# EasyEDA Pro project v8_fBACKUP as orderered.eprj

# Schematic Schematic1
Board Name: Board1; Create Date: 2025-07-11; Page Name: P1; Project Name: v8_f; Schematic Name: Schematic1; Update Date: 2025-08-22; Company: KC3LBR; Drawed: EasyEDA Pro; Page Size: A3; Part Number: JLCPCB-001; Reviewed: EasyEDA Pro; Version: 2023.09.11
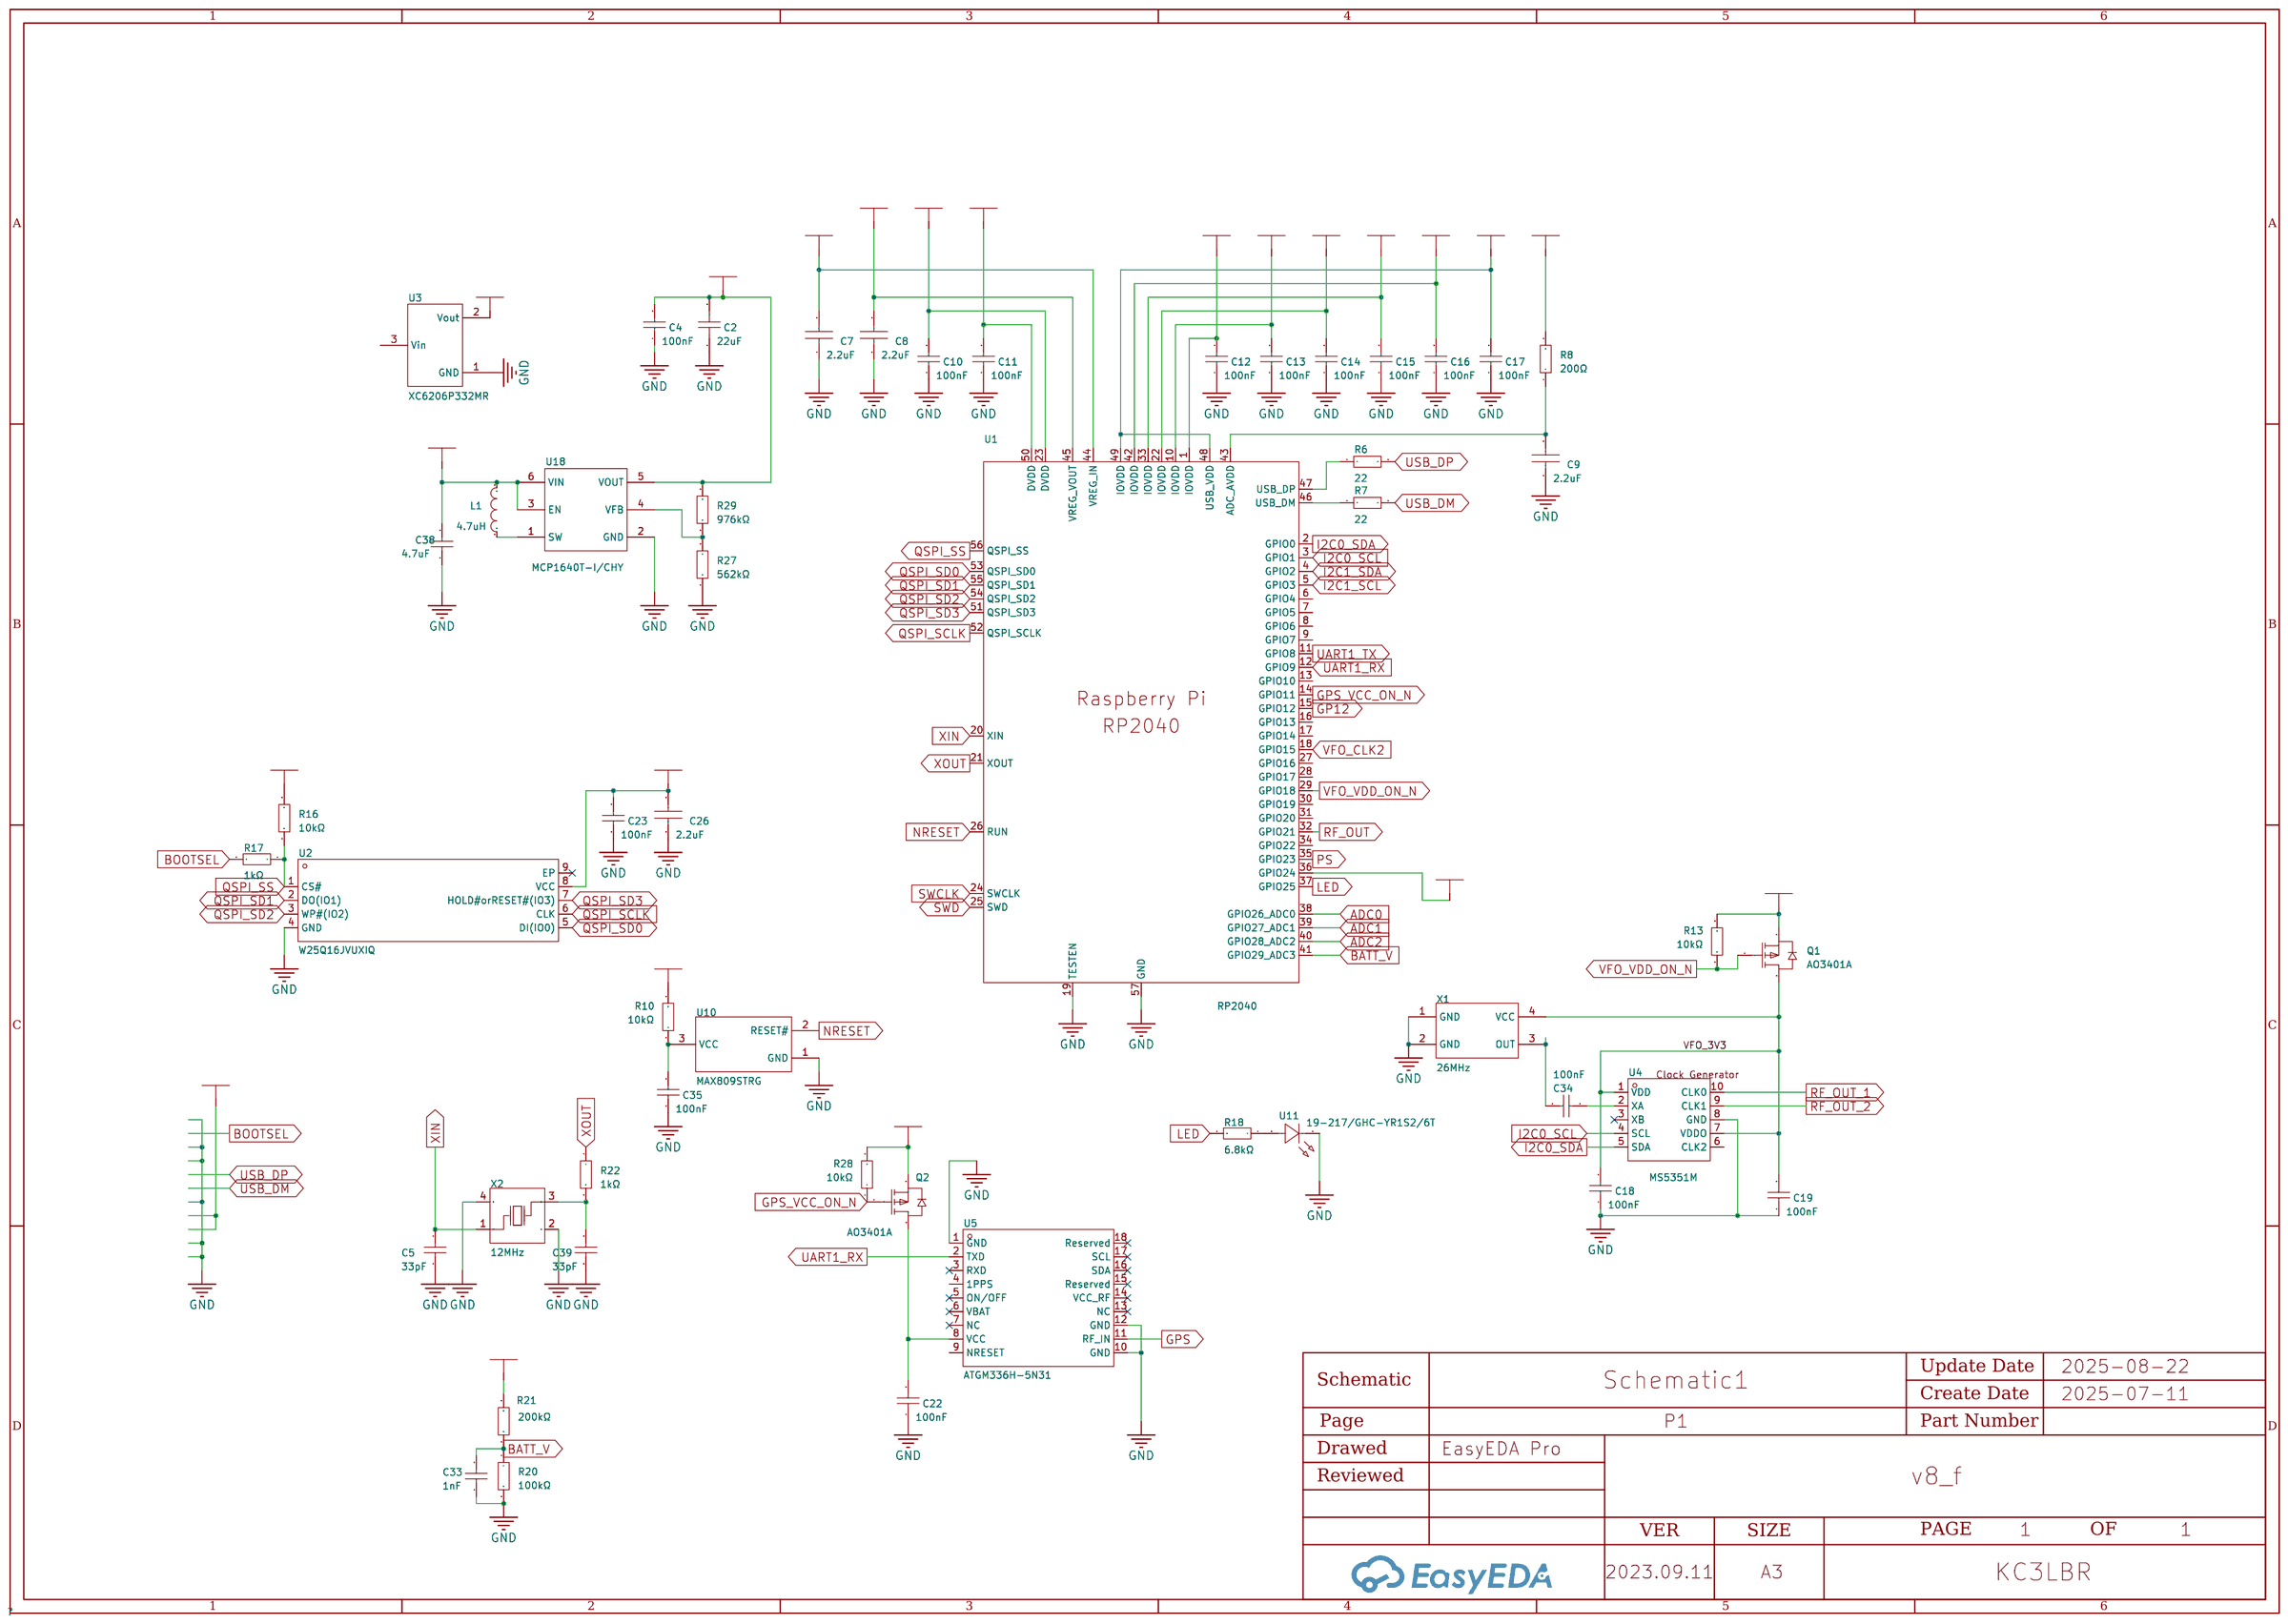
[diagram p0: schematic sheet]

## Parts
C2  22uF  [C0603]
C4  100nF  [C0402]
C5  33pF  [C0402]
C7  2.2uF  [C0402]
C8  2.2uF  [C0402]
C9  2.2uF  [C0402]
C10  100nF  [C0402]
C11  100nF  [C0402]
C12  100nF  [C0402]
C13  100nF  [C0402]
C14  100nF  [C0402]
C15  100nF  [C0402]
C16  100nF  [C0402]
C17  100nF  [C0402]
C18  100nF  [C0402_NEW]
C19  100nF  [C0402_NEW]
C22  100nF  [C0402]
C23  100nF  [C0402]
C26  2.2uF  [C0402]
C33  1nF  [C0402]
C34  100nF  [C0402_NEW]
C35  100nF  [C0402_NEW]
C38  4.7uF  [C0603]
C39  33pF  [C0402]
L1  4.7uH  [IND-SMD_L2.5-W1.8]
Q1  AO3401A  [SOT-23_L2.9-W1.3-P1.90-LS2.4-BR]
Q2  AO3401A  [SOT-23_L2.9-W1.3-P1.90-LS2.4-BR]
R6  22  [R0402]
R7  22  [R0402]
R8  200Ω  [R0402]
R10  10kΩ  [R0402]
R13  10kΩ  [R0402]
R16  10kΩ  [R0402]
R17  1kΩ  [R0402]
R18  6.8kΩ  [R0402]
R20  100kΩ  [R0402]
R21  200kΩ  [R0402]
R22  1kΩ  [R0402]
R27  562kΩ  [R0402]
R28  10kΩ  [R0402]
R29  976kΩ  [R0402]
U1  RP2040  [LQFN-56_L7.0-W7.0-P0.4-EP]
U2  W25Q16JVUXIQ  [USON-8_L3.0-W2.0-P0.50-BL-EP]
U3  XC6206P332MR  [SOT-23-3_L2.9-W1.3-P1.90-LS2.4-BR]
U4  MS5351M  [MSOP-10_L3.0-W3.0-P0.50-LS5.0-BL]
U5  ATGM336H-5N31  [GPSM-SMD_ATGM336H-TR]
U10  MAX809STRG  [SOT-23-3_L2.9-W1.6-P1.90-LS2.8-BR]
U11  19-217/GHC-YR1S2/6T  [LED0603-RD_GREEN]
U18  MCP1640T-I/CHY  [SOT-23-6_L2.9-W1.6-P0.95-LS2.8-BR]
X1  26MHz  [OSC-SMD_4P-L2.5-W2.0-BL]
X2  12MHz  [CRYSTAL-SMD_4P-L3.2-W2.5-BL]

## Library data of the parts
C2 = CL10A226MQ8NRNC: Capacitance: Tolerance:±20% Tolerance:±20% Voltage Rated: Temperature Coefficient:; LCSC Part Name: 22uF ±20% 6.3V; Supplier Part: C59461; Manufacturer: SAMSUNG(三星); Supplier Footprint: 0603; JLCPCB Part Class: Basic Part; Datasheet: https://atta.szlcsc.com/upload/public/pdf/source/20160218/1457707763339.pdf; Supplier: LCSC; Tolerance: ±20%
C4 C10-C17 C22 C23 = CL05B104KO5NNNC: Capacitance: Tolerance:±10% Tolerance:±10% Voltage Rated: Temperature Coefficient:; LCSC Part Name: 100nF ±10% 16V; Supplier Part: C1525; Manufacturer: SAMSUNG(三星); Supplier Footprint: 0402; JLCPCB Part Class: Basic Part; Datasheet: https://atta.szlcsc.com/upload/public/pdf/source/20160218/1457707763339.pdf; Supplier: LCSC; Tolerance: ±10%
C5 C39 = 0402CG330J500NT: Capacitance: Tolerance:±5% Tolerance:±5% Voltage Rated: Temperature Coefficient:; LCSC Part Name: 33pF ±5% 50V; Supplier Part: C1562; Manufacturer: FH(风华); Supplier Footprint: 0402; JLCPCB Part Class: Basic Part; Datasheet: https://atta.szlcsc.com/upload/public/pdf/source/20200305/C486355_26A10D38EF8C2A5C37091D0039909270.pdf; Supplier: LCSC; Tolerance: ±5%
C7-C9 C26 = CL05A225MQ5NSNC: Capacitance: Tolerance:±20% Tolerance:±20% Voltage Rated: Temperature Coefficient:; LCSC Part Name: 2.2uF ±20% 6.3V; Supplier Part: C12530; Manufacturer: SAMSUNG(三星); Supplier Footprint: 0402; JLCPCB Part Class: Basic Part; Datasheet: https://atta.szlcsc.com/upload/public/pdf/source/20160218/1457707763339.pdf; Supplier: LCSC; Tolerance: ±20%
C18 C19 C34 C35 = CL05B104KO5NNNC: Capacitance: Tolerance:±10% Tolerance:±10% Voltage Rated: Temperature Coefficient:; LCSC Part Name: 100nF ±10% 16V; Supplier Part: C1525; Manufacturer: SAMSUNG(三星); Supplier Footprint: 0402; JLCPCB Part Class: Basic Part; Datasheet: https://atta.szlcsc.com/upload/public/pdf/source/20160103/1457707674891.pdf; Supplier: LCSC; Tolerance: ±10%
C33 = 0402B102K500NT: Capacitance: Tolerance:±10% Tolerance:±10% Voltage Rated: Temperature Coefficient:; LCSC Part Name: 1nF ±10% 50V; Supplier Part: C1523; Manufacturer: FH(风华); Supplier Footprint: 0402; JLCPCB Part Class: Basic Part; Datasheet: https://atta.szlcsc.com/upload/public/pdf/source/20170923/C1523_1506149254821988331.pdf; Supplier: LCSC; Tolerance: ±10%
C38 = CL10A475KO8NNNC: Capacitance: Tolerance:±10% Tolerance:±10% Voltage Rated: Temperature Coefficient:; LCSC Part Name: 4.7uF ±10% 16V; Supplier Part: C19666; Manufacturer: SAMSUNG(三星); Supplier Footprint: 0603; JLCPCB Part Class: Basic Part; Datasheet: https://atta.szlcsc.com/upload/public/pdf/source/20160103/1457707703134.pdf; Supplier: LCSC; Tolerance: ±10%
L1 = CBC2518T4R7M: Type:- Inductance: Tolerance:±20% Tolerance:±20% Rated Current: Saturation Current (Isat):680mA DC Resistance (DCR): Ratings:-; LCSC Part Name: 4.7uH ±20% 680mA; Supplier Part: C268002; Manufacturer: TAIYO YUDEN(太诱); Supplier Footprint: SMD; JLCPCB Part Class: Extended Part; Datasheet: https://atta.szlcsc.com/upload/public/pdf/source/20180820/C268002_0E22732304EF0852B3951C6629BBBAB5.pdf; Supplier: LCSC; Tolerance: ±20%; Saturation Current (Isat): 680mA
Q1 Q2 = AO3401A_C15127: Type: Drain Source Voltage (Vdss): Continuous Drain Current (Id): Power Dissipation (Pd): Drain Source On Resistance (RDS(on)@Vgs,Id):44mΩ@10V,4.3A Gate Threshold Voltage (Vgs(th)@Id):1.3V@250uA; LCSC Part Name: P沟道 30V 4A; Supplier Part: C15127; Manufacturer: AOS; Supplier Footprint: SOT-23; JLCPCB Part Class: Basic Part; Datasheet: https://atta.szlcsc.com/upload/public/pdf/source/20160507/1462613609053.pdf; Supplier: LCSC; Drain Source On Resistance (RDS(on)@Vgs,Id): 44mΩ@10V,4.3A; Gate Threshold Voltage (Vgs(th)@Id): 1.3V@250uA
R6 R7 = 0402WGF220JTCE: LCSC Part Name: 22Ω(22R0) ±1% 编带; Supplier Part: C25092; Manufacturer: UNI-ROYAL(厚声); Supplier Footprint: 0402; JLCPCB Part Class: Basic Part; Datasheet: https://atta.szlcsc.com/upload/public/pdf/source/20170920/C25092_1505901206069982723.pdf; Supplier: LCSC
R8 = 0402WGF2000TCE: Type:Thick Film Resistors Resistance: Tolerance:±1% Tolerance:±1% Power(Watts): Temperature Coefficient:±100ppm/ Temperature Coefficient:±100ppm/ Overload Voltage (Max): Operating Temperature Range:-55~+155 Operating Temperature Range:-55~+155; LCSC Part Name: 200Ω ±1% 62.5mW; Supplier Part: C25087; Manufacturer: UNI-ROYAL(厚声); Supplier Footprint: 0402; JLCPCB Part Class: Basic Part; Datasheet: https://atta.szlcsc.com/upload/public/pdf/source/20200306/C422600_1E6D84923E4A46A82E41ADD87F860B5C.pdf; Supplier: LCSC; Type: Thick Film Resistors; Tolerance: ±1%; Temperature Coefficient: ±100ppm/; Operating Temperature Range: -55~+155
R10 R13 R16 R28 = 0402WGF1002TCE: Type:Thick Film Resistors Resistance: Tolerance:±1% Tolerance:±1% Power(Watts): Temperature Coefficient:±100ppm/ Temperature Coefficient:±100ppm/ Overload Voltage (Max): Operating Temperature Range:-55~+155 Operating Temperature Range:-55~+155; LCSC Part Name: 10kΩ ±1% 62.5mW; Supplier Part: C25744; Manufacturer: UNI-ROYAL(厚声); Supplier Footprint: 0402; JLCPCB Part Class: Basic Part; Datasheet: https://atta.szlcsc.com/upload/public/pdf/source/20200306/C422600_1E6D84923E4A46A82E41ADD87F860B5C.pdf; Supplier: LCSC; Type: Thick Film Resistors; Tolerance: ±1%; Temperature Coefficient: ±100ppm/; Operating Temperature Range: -55~+155
R17 R22 = 0402WGF1001TCE: Type:Thick Film Resistors Resistance: Tolerance:±1% Tolerance:±1% Power(Watts): Temperature Coefficient:±100ppm/ Temperature Coefficient:±100ppm/ Overload Voltage (Max): Operating Temperature Range:-55~+155 Operating Temperature Range:-55~+155; LCSC Part Name: 1kΩ ±1% 62.5mW; Supplier Part: C11702; Manufacturer: UNI-ROYAL(厚声); Supplier Footprint: 0402; JLCPCB Part Class: Basic Part; Datasheet: https://atta.szlcsc.com/upload/public/pdf/source/20200306/C422600_1E6D84923E4A46A82E41ADD87F860B5C.pdf; Supplier: LCSC; Type: Thick Film Resistors; Tolerance: ±1%; Temperature Coefficient: ±100ppm/; Operating Temperature Range: -55~+155
R18 = 0402WGF6801TCE: Type:Thick Film Resistors Resistance: Tolerance:±1% Tolerance:±1% Power(Watts): Temperature Coefficient:±100ppm/ Temperature Coefficient:±100ppm/ Overload Voltage (Max): Operating Temperature Range:-55~+155 Operating Temperature Range:-55~+155; LCSC Part Name: 6.8kΩ ±1% 62.5mW; Supplier Part: C25917; Manufacturer: UNI-ROYAL(厚声); Supplier Footprint: 0402; JLCPCB Part Class: Basic Part; Datasheet: https://atta.szlcsc.com/upload/public/pdf/source/20200306/C422600_1E6D84923E4A46A82E41ADD87F860B5C.pdf; Supplier: LCSC; Type: Thick Film Resistors; Tolerance: ±1%; Temperature Coefficient: ±100ppm/; Operating Temperature Range: -55~+155
R20 = 0402WGF1003TCE: Type:Thick Film Resistors Resistance: Tolerance:±1% Tolerance:±1% Power(Watts): Temperature Coefficient:±100ppm/ Temperature Coefficient:±100ppm/ Overload Voltage (Max): Operating Temperature Range:-55~+155 Operating Temperature Range:-55~+155; LCSC Part Name: 100kΩ ±1% 62.5mW; Supplier Part: C25741; Manufacturer: UNI-ROYAL(厚声); Supplier Footprint: 0402; JLCPCB Part Class: Basic Part; Datasheet: https://atta.szlcsc.com/upload/public/pdf/source/20200306/C422600_1E6D84923E4A46A82E41ADD87F860B5C.pdf; Supplier: LCSC; Type: Thick Film Resistors; Tolerance: ±1%; Temperature Coefficient: ±100ppm/; Operating Temperature Range: -55~+155
R21 = 0402WGF2003TCE: Resistance: Tolerance: Power(Watts): Temperature Coefficient: Temperature Coefficient: Overload Voltage (Max): Operating Temperature Range: Operating Temperature Range:; LCSC Part Name: 200KΩ ±1%; Supplier Part: C25764; Manufacturer: UNI-ROYAL(厚声); Supplier Footprint: 0402; JLCPCB Part Class: Basic Part; Datasheet: https://atta.szlcsc.com/upload/public/pdf/source/20170920/C25764_1505901532268983339.pdf; Supplier: LCSC
R27 = RC0402FR-07562KL: Type:Thick Film Resistors Resistance: Tolerance:±1% Tolerance:±1% Power(Watts): Overload Voltage (Max): Temperature Coefficient:±100ppm/℃ Temperature Coefficient:±100ppm/℃ Operating Temperature Range:-55℃~+155℃ Operating Temperature Range:-55℃~+155℃; LCSC Part Name: 厚膜电阻 562kΩ ±1% 62.5mW; Supplier Part: C273337; Manufacturer: YAGEO(国巨); Supplier Footprint: 0402; JLCPCB Part Class: Extended Part; Datasheet: https://atta.szlcsc.com/upload/public/pdf/source/20180821/C275644_0D56F95EFF785E7D9A1FEF436B37DA78.pdf; Supplier: LCSC; Type: Thick Film Resistors; Tolerance: ±1%; Temperature Coefficient: ±100ppm/℃; Operating Temperature Range: -55℃~+155℃
R29 = 0402WGF9763TCE: Type:Thick Film Resistor Resistance:976kΩ Tolerance:±1% Tolerance:±1% Power(Watts):62.5mW Voltage-Supply(Max):50V Temperature Coefficient:±100ppm/℃ Temperature Coefficient:±100ppm/℃ Operating Temperature:-55℃~+155℃ Operating Temperature:-55℃~+155℃; LCSC Part Name: 976kΩ ±1% 62.5mW 厚膜电阻; Supplier Part: C25802; Manufacturer: UNI-ROYAL(厚声); Supplier Footprint: 0402; JLCPCB Part Class: Extended Part; Datasheet: https://item.szlcsc.com/datasheet/0402WGF9763TCE/26545.html; Supplier: LCSC; Type: Thick Film Resistor; Tolerance: ±1%; Power(Watts): 62.5mW; Voltage-Supply(Max): 50V; Temperature Coefficient: ±100ppm/℃; Operating Temperature: -55℃~+155℃
U1 = RP2040_C2040: CPU Core:- RAM Size:264KB GPIO Ports Number:30 Operating Voltage Range:- Operating Voltage Range:- CPU Maximum Speed:133MHz Program Memory Type:- Operating Temperature Range:- Operating Temperature Range:- ADC (Bit):12bit DAC (Bit):- PWM (Bit):- 8Bit Time; LCSC Part Name: RP2040（RP2B2）; Supplier Part: C2040; Manufacturer: Raspberry Pi(树莓派); Supplier Footprint: LQFN-56(7x7); JLCPCB Part Class: Extended Part; Datasheet: https://atta.szlcsc.com/upload/public/pdf/source/20210621/C2040_96F425825606B7957D87DD32E2512CA9.pdf; Supplier: LCSC; Maximum Frequency: 133MHz; RAM Size: 264KB; GPIO Ports Number: 30; ADC (Units/Channels/bits): 1@x4ch/12bit; U(S)ART Number: 2; I2C Number: 2; (Q)SPI Number: 2; USB (H/D/OTG): USB Host/Device; Peripherals / Functions / Protocol Stacks: DMA；PWM; CPU Maximum Speed: 133MHz; ADC (Bit): 12bit; UART/USART: 2; I2C: 2; SPI: 2; Universal Serial Bus: 有; Peripheral/Function: DMA；PWM; Direct Memory Access: 有
U2 = W25Q16JVUXIQ: Supplier Part: C2843335; Manufacturer: WINBOND(华邦); Supplier Footprint: USON-8-EP(2x3); JLCPCB Part Class: Extended Part; Datasheet: https://atta.szlcsc.com/upload/public/pdf/source/20210629/C2843335_FB4D78B5076715625DC0C83F790D3044.pdf; Supplier: LCSC
U3 = XC6206P332MR_C6430947: Supplier Part: C6430947; Manufacturer: GOODWORK(固得沃克); Supplier Footprint: SOT-23; JLCPCB Part Class: Extended Part; Datasheet: https://atta.szlcsc.com/upload/public/pdf/source/20240218/986B5B990190AC417C3A75943F9A285D.pdf; Supplier: LCSC
U4 = MS5351M: Clock Generator; Supplier Part: C1509083; Manufacturer: 杭州瑞盟; Supplier Footprint: MSOP-10; JLCPCB Part Class: Extended Part; Datasheet: https://atta.szlcsc.com/upload/public/pdf/source/20201224/C1509083_CDA7065E1A3FD8463EE02C96BD32A982.pdf; Supplier: LCSC; Interface: IIC; Output Frequency (Max): 200MHz; Supply Voltage: 2.25V~3.6V; Number of Outputs: 3; Output Low Voltage: 0.6V; Output High Voltage: 2.7V; Operating Temperatue: -55~+150
U5 = ATGM336H-5N31: LCSC Part Name: BDS/GNSS 全星座定位导航模块; Supplier Part: C90770; Manufacturer: 杭州中科微; Supplier Footprint: SMD,9.7x10.1mm; JLCPCB Part Class: Extended Part; Datasheet: https://atta.szlcsc.com/upload/public/pdf/source/20161226/1482720799860.pdf; Supplier: LCSC
U10 = MAX809STRG: Output Type:推挽 Reset Active Level:低电平有效 Number of Voltages Monitored:1 Threshold Voltage:2.93V Reset Timeout:140ms Operating Temperature:-40~+105@(TJ) Operating Temperature:-40~+105@(TJ) Type of the Power Management Chip:Simple reset/Power-on reset; LCSC Part Name: Voltage Supervisor, Very Low Supply Current, 3-Pin Microprocessor, Reset Monitor; Supplier Part: C9965; Manufacturer: onsemi(安森美); Supplier Footprint: SOT-23; JLCPCB Part Class: Extended Part; Datasheet: https://atta.szlcsc.com/upload/public/pdf/source/20170918/C9965_1505727085373976535.PDF; Supplier: LCSC; Output Type: 推挽; Reset Active Level: 低电平有效; Number of Voltages Monitored: 1; Threshold Voltage: 2.93V; Reset Timeout: 140ms; Operating Temperature: -40~+105@(TJ); Type of the Power Management Chip: Simple reset/Power-on reset
U11 = 19-217/GHC-YR1S2/6T: LCSC Part Name: 翠绿; Supplier Part: C2986059; Manufacturer: EVERLIGHT(亿光); Supplier Footprint: 0603; JLCPCB Part Class: Extended Part; Datasheet: https://atta.szlcsc.com/upload/public/pdf/source/20220705/5270194960AA522E2931401D212035CB.pdf; Supplier: LCSC
U18 = MCP1640T-I/CHY: Function:Boost type Synchronous Rectification:Yes Number of Outputs:1 Topology:Boost Input Voltage:0.8V~5.5V Input Voltage:0.8V~5.5V Output Voltage:2V~5.5V Output Voltage:2V~5.5V Output Current (Max):350mA Switching Frequency:500kHz; LCSC Part Name: 升压型 Vin=0.8V~5.5V Vout=2V~5.5V 350mA; Supplier Part: C44365; Manufacturer: MICROCHIP(美国微芯); Supplier Footprint: SOT-23-6; JLCPCB Part Class: Extended Part; Datasheet: https://atta.szlcsc.com/upload/public/pdf/source/20150319/1457707270677.pdf; Supplier: LCSC; Function: Boost type; Synchronous Rectification: Yes; Number of Outputs: 1; Topology: Boost; Input Voltage: 0.8V~5.5V; Output Voltage: 2V~5.5V; Output Current (Max): 350mA; Switching Frequency: 500kHz
X1 = 1XXB26000MAA: Frequency: Frequency Stability:±1.5ppm Frequency Stability:±1.5ppm Supply Voltage:1.8V~2.8V Supply Voltage:1.8V~2.8V Supply Current (Max): Operating Temperature: Operating Temperature:; LCSC Part Name: 26MHz ±1.5ppm; Supplier Part: C132296; Manufacturer: KDS(大真空); Supplier Footprint: SMD2520-4P; JLCPCB Part Class: Extended Part; Datasheet: https://atta.szlcsc.com/upload/public/pdf/source/20171018/C132296_15083234896291043042.pdf; Supplier: LCSC; Frequency Stability: ±1.5ppm; Supply Voltage: 1.8V~2.8V
X2 = X322512MSB4SI: Crystal Type:Surface Mount Crystal Frequency: Normal temperature Frequency Tolerance:±10ppm Normal temperature Frequency Tolerance:±10ppm External load capacitor: Frequency Stability(Full temperature range):±20ppm Frequency Stability(Full temperature rang; LCSC Part Name: 12MHz ±10ppm 20pF; Supplier Part: C9002; Manufacturer: YXC(扬兴晶振); Supplier Footprint: SMD3225-4P; JLCPCB Part Class: Basic Part; Datasheet: https://atta.szlcsc.com/upload/public/pdf/source/20240329/19D5F850207469550BEB00D7DFEDBC7A.pdf; Supplier: LCSC; Crystal Type: Surface Mount Crystal; Normal temperature Frequency Tolerance: ±10ppm; Frequency Stability(Full temperature range): ±20ppm

## Nets
1V1: C8.2 C10.2 C11.2 U1.23(DVDD) U1.45(VREG_VOUT) U1.50(DVDD)
3V3: C2.2 C4.2 C7.2 C12.2 C13.2 C14.2 C15.2 C16.2 C17.2 C23.2 C26.2 Q1.2(S) Q2.2(S) R8.2 R10.2 R13.2 R16.2 R28.2 R29.2 U1.1(IOVDD) U1.10(IOVDD) U1.22(IOVDD) U1.33(IOVDD) U1.36(GPIO24) U1.42(IOVDD) U1.44(VREG_IN) U1.48(USB_VDD) U1.49(IOVDD) U2.8(VCC) U18.5(VOUT)
GND: C2.1 C4.1 C5.1 C7.1 C8.1 C9.1 C10.1 C11.1 C12.1 C13.1 C14.1 C15.1 C16.1 C17.1 C18.1 C19.1 C22.1 C23.1 C26.1 C33.1 C35.1 C38.1 C39.1 R20.2 R27.1 U1.19(TESTEN) U1.57(GND) U2.4(GND) U3.1(GND) U4.8(GND) U5.1(GND) U5.10(GND) U5.12(GND) U10.1(GND) U11.1(K) U18.2(GND) X1.1(GND) X1.2(GND) X2.2(GND) X2.4(GND)
VBUS: C38.2 L1.2 R21.2 U3.2(Vout) U18.3(EN) U18.6(VIN)
ADC0: U1.38(GPIO26_ADC0)
ADC1: U1.39(GPIO27_ADC1)
ADC2: U1.40(GPIO28_ADC2)
ADC_AVDD: C9.2 R8.1 U1.43(ADC_AVDD)
BATT_V: C33.2 R20.1 R21.1 U1.41(GPIO29_ADC3)
BOOTSEL: R17.2
GP12: U1.15(GPIO12)
GPS: U5.11(RF_IN)
GPS_3V3: C22.2 Q2.3(D) U5.8(VCC)
GPS_VCC_ON_N: Q2.1(G) R28.1 U1.14(GPIO11)
I2C0_SCL: U1.3(GPIO1) U4.4(SCL)
I2C0_SDA: U1.2(GPIO0) U4.5(SDA)
I2C1_SCL: U1.5(GPIO3)
I2C1_SDA: U1.4(GPIO2)
LED: R18.2 U1.37(GPIO25)
NRESET: U1.26(RUN) U10.2(RESET#)
PS: U1.35(GPIO23)
QSPI_SCLK: U1.52(QSPI_SCLK) U2.6(CLK)
QSPI_SD0: U1.53(QSPI_SD0) U2.5(DI(IO0))
QSPI_SD1: U1.55(QSPI_SD1) U2.2(DO(IO1))
QSPI_SD2: U1.54(QSPI_SD2) U2.3(WP#(IO2))
QSPI_SD3: U1.51(QSPI_SD3) U2.7(HOLD#orRESET#(IO3))
QSPI_SS: R16.1 R17.1 U1.56(QSPI_SS) U2.1(CS#)
RF_OUT: U1.32(GPIO21)
RF_OUT_1: U4.10(CLK0)
RF_OUT_2: U4.9(CLK1)
SWCLK: U1.24(SWCLK)
SWD: U1.25(SWD)
UART1_RX: U1.12(GPIO9) U5.2(TXD)
UART1_TX: U1.11(GPIO8)
USB_DM: R7.2
USB_DP: R6.2
VFO_3V3: C18.2 C19.2 Q1.3(D) U4.1(VDD) U4.7(VDDO) X1.4(VCC)
VFO_CLK2: U1.18(GPIO15)
VFO_VDD_ON_N: Q1.1(G) R13.1 U1.29(GPIO18)
XIN: C5.2 U1.20(XIN) X2.1(OSC1)
XOUT: R22.1 U1.21(XOUT)
$1N22007: R7.1 U1.46(USB_DM)
$1N22362: R6.1 U1.47(USB_DP)
$1N70752: C39.2 R22.2 X2.3(OSC2)
$1N115739: C35.2 R10.1 U10.3(VCC)
$1N146095: R18.1 U11.2(A)
$1N152319: L1.1 U18.1(SW)
$1N152323: R27.2 R29.1 U18.4(VFB)
$1N173176: C34.1 U4.2(XA)
$1N173179: C34.2 X1.3(OUT)

Not connected (* = marked no-connect by the designer): U1 6(GPIO4) 7(GPIO5) 8(GPIO6) 9(GPIO7) 13(GPIO10) 16(GPIO13) 17(GPIO14) 27(GPIO16) 28(GPIO17) 30(GPIO19) 31(GPIO20) 34(GPIO22); U2 9(EP)*; U3 3(Vin); U4 3(XB)* 6(CLK2); U5 3(RXD)* 4(1PPS) 5(ON/OFF)* 6(VBAT)* 7(NC)* 9(NRESET) 13(NC)* 14(VCC_RF)* 15(Reserved)* 16(SDA)* 17(SCL)* 18(Reserved)*

# Board PCB1
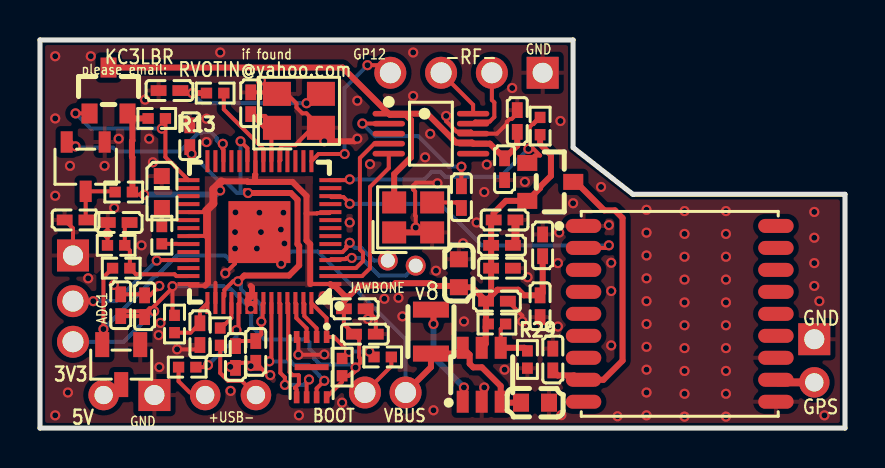
[diagram p1: board, top side]
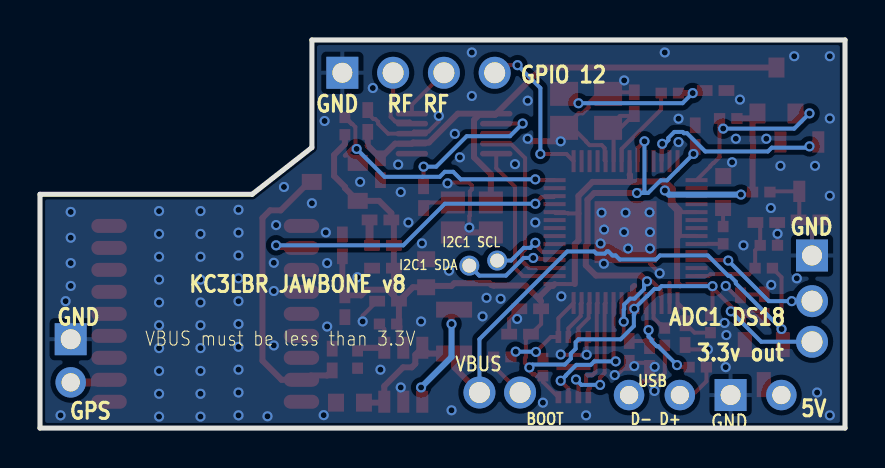
[diagram p2: board, bottom side, seen from below]

Outline 40.27 x 19.42 mm; copper layers: Top Layer, Bottom Layer. Coordinates in mm from the lower left corner of the outline.
Outline path: 0,19.42 26.67,19.42 26.67,14.04 29.66,11.7 40.27,11.7 40.27,0 0,0 0,19.42
Stack: Top Layer 0.035mm / Dielectric1 1.51mm FR4 er 4.5 / Bottom Layer 0.035mm

## Design rules (mm)
template: User Custom Config
spacing safeClearance (default): track to track 0.152, other pairs 0.12 to 0.3
track width trackWidth (default): min 0.127, default 0.154, max 2.54
track width ThickTrack: min 0.3, default 0.4, max 2.54
differential pair differentialPair (default): width min 0.127, default 0.254, max 2.54; gap min 0.152, default 0.152
via viaSize (default): diameter min 0.5, default 0.508, max 10; hole min 0.3, default 0.3, max 5.999

## Placement (name value [footprint] x y rotation side)
C2  22uF  [C0603]  20.96 7.75 270 top
C4  100nF  [C0402]  16.26 4.7 180 top
C5  33pF  [C0402]  10.54 16.26 270 top
C7  2.2uF  [C0402]  5.23 6.1 270 top
C8  2.2uF  [C0402]  10.8 3.81 90 top
C9  2.2uF  [C0402]  8 4.7 90 top
C10  100nF  [C0402]  7.49 14.61 270 top
C11  100nF  [C0402]  9.78 3.56 90 top
C12  100nF  [C0402]  23.11 8 180 top
C13  100nF  [C0402]  25.15 9.14 270 top
C14  100nF  [C0402]  22.86 6.35 180 top
C15  100nF  [C0402]  4.04 6.15 270 top
C16  100nF  [C0402]  15.75 5.97 180 top
C17  100nF  [C0402]  23.11 9.14 180 top
C18  100nF  [C0402_NEW]  23.24 12.95 90 top
C19  100nF  [C0402_NEW]  23.88 15.37 270 top
C22  100nF  [C0402]  25.65 3.43 270 top
C23  100nF  [C0402]  25.02 6.1 90 top
C26  2.2uF  [C0402]  23.24 10.41 180 top
C33  1nF  [C0402]  3.94 10.29 0 top
C34  100nF  [C0402_NEW]  21.08 11.56 270 top
C35  100nF  [C0402_NEW]  1.78 10.41 0 top
C38  4.7uF  [C0603]  24.77 1.27 180 top
C39  33pF  [C0402]  6.48 16.89 0 top
L1  4.7uH  [IND-SMD_L2.5-W1.8]  19.56 4.83 270 top
NOREF  -  [Pad_e19]  5.72 1.65 0 top
NOREF#2  -  [Pad_e5]  18.8 8.13 0 top
NOREF#3  -  [Pad_e1305]  1.65 4.32 0 top
NOREF#4  -  [Pad_e1583]  18.29 1.78 0 top
NOREF#5  -  [Pad_e1763]  10.8 1.65 0 top
NOREF#6  -  [Pad_e813]  25.15 17.78 0 top
NOREF#7  -  [Pad_e620]  22.61 17.78 0 top
NOREF#8  -  [Pad_e37]  38.74 4.45 0 top
NOREF#9  -  [Pad_e833]  1.65 8.64 0 top
NOREF#10  -  [Pad_e10]  3.18 1.65 0 top
NOREF#11  -  [Pad_e4139]  16.26 1.78 0 top
NOREF#12  -  [Pad_e2]  38.74 2.29 0 top
NOREF#13  -  [Pad_e41]  1.65 6.35 0 top
NOREF#14  -  [Pad_e4]  17.4 8.38 0 top
NOREF#15  -  [Pad_e796]  17.53 17.78 0 top
NOREF#16  -  [Pad_e617]  20.07 17.78 0 top
NOREF#17  -  [Pad_e1784]  8.26 1.65 0 top
Q1  AO3401A  [SOT-23_L2.9-W1.3-P1.90-LS2.4-BR]  3.43 16.89 270 top
Q2  AO3401A  [SOT-23_L2.9-W1.3-P1.90-LS2.4-BR]  25.53 12.32 180 top
R6  22  [R0402]  7.37 3.05 180 top
R7  22  [R0402]  9.02 4.57 270 top
R8  200Ω  [R0402]  6.73 5.21 90 top
R10  10kΩ  [R0402]  4.19 11.81 0 top
R13  10kΩ  [R0402]  5.84 15.49 180 top
R16  10kΩ  [R0402]  15.11 3.05 270 top
R17  1kΩ  [R0402]  17.15 3.56 0 top
R18  6.8kΩ  [R0402]  6.1 9.65 270 top
R20  100kΩ  [R0402]  3.81 9.14 180 top
R21  200kΩ  [R0402]  4.06 8 180 top
R22  1kΩ  [R0402]  8.76 16.76 180 top
R27  562kΩ  [R0402]  24.38 3.43 90 top
R28  10kΩ  [R0402]  25.02 15.11 270 top
R29  976kΩ  [R0402]  22.86 5.21 180 top
U1  RP2040  [LQFN-56_L7.0-W7.0-P0.4-EP]  10.98 9.81 180 top
U2  W25Q16JVUXIQ  [USON-8_L3.0-W2.0-P0.50-BL-EP]  13.59 3.05 180 top
U3  XC6206P332MR  [SOT-23-3_L2.9-W1.3-P1.90-LS2.4-BR]  4.06 3.17 90 top
U4  MS5351M  [MSOP-10_L3.0-W3.0-P0.50-LS5.0-BL]  19.56 14.73 270 top
U5  ATGM336H-5N31  [GPSM-SMD_ATGM336H-TR]  32 5.72 90 top
U10  MAX809STRG  [SOT-23-3_L2.9-W1.6-P1.90-LS2.8-BR]  2.29 13.08 90 top
U11  19-217/GHC-YR1S2/6T  [LED0603-RD_GREEN]  6.1 11.81 270 top
U18  MCP1640T-I/CHY  [SOT-23-6_L2.9-W1.6-P0.95-LS2.8-BR]  22.1 2.67 270 top
X1  26MHz  [OSC-SMD_4P-L2.5-W2.0-BL]  18.67 10.54 0 top
X2  12MHz  [CRYSTAL-SMD_4P-L3.2-W2.5-BL]  12.95 15.88 0 top

## Footprints (pads in the part's own frame, mm; a bottom-side part is the same pattern mirrored in y, then rotated)
C0402
  rect 0.79x0.54 smd: 1(-0.545,0) 2(0.545,0)
C0402_NEW
  rect 0.79x0.54 smd: 1(-0.545,0) 2(0.545,0)
C0603
  rect 0.8x0.9 smd: 1(-0.7,0) 2(0.7,0)
CRYSTAL-SMD_4P-L3.2-W2.5-BL
  rect 1.4x1.2 smd: 1(-1.1,-0.85) 2(1.1,-0.85) 3(1.1,0.85) 4(-1.1,0.85)
GPSM-SMD_ATGM336H-TR
  oval 0.7x1.773 smd: 1(4.4,4.811) 2(3.3,4.811) 3(2.2,4.811) 4(1.1,4.811) 5(0,4.811) 6(-1.1,4.811) 7(-2.2,4.811) 8(-3.3,4.811) 9(-4.4,4.811) 10(-4.4,-4.811) 11(-3.3,-4.811) 12(-2.2,-4.811) 13(-1.1,-4.811) 14(0,-4.811) 15(1.1,-4.811) 16(2.2,-4.811) 17(3.3,-4.811) 18(4.4,-4.811)
IND-SMD_L2.5-W1.8
  rect 0.8x1.8 smd: 1(-1.1,0) 2(1.1,0)
LED0603-RD_GREEN
  rect 0.8x0.8 smd: 1(-0.799,-0.004) 2(0.799,0.004)
LQFN-56_L7.0-W7.0-P0.4-EP
  rect 1.1x0.2 smd: 1(-3.55,2.6) 2(-3.55,2.2) 3(-3.55,1.8) 4(-3.55,1.4) 5(-3.55,1) 6(-3.55,0.6) 7(-3.55,0.2) 8(-3.55,-0.2) 9(-3.55,-0.6) 10(-3.55,-1) 11(-3.55,-1.4) 12(-3.55,-1.8) 13(-3.55,-2.2) 14(-3.55,-2.6) 29(3.55,-2.6) 30(3.55,-2.2) 31(3.55,-1.8) 32(3.55,-1.4) 33(3.55,-1) 34(3.55,-0.6) 35(3.55,-0.2) 36(3.55,0.2) 37(3.55,0.6) 38(3.55,1) 39(3.55,1.4) 40(3.55,1.8) 41(3.55,2.2) 42(3.55,2.6)
  rect 0.2x1.1 smd: 15(-2.6,-3.55) 16(-2.2,-3.55) 17(-1.8,-3.55) 18(-1.4,-3.55) 19(-1,-3.55) 20(-0.6,-3.55) 21(-0.2,-3.55) 22(0.2,-3.55) 23(0.6,-3.55) 24(1,-3.55) 25(1.4,-3.55) 26(1.8,-3.55) 27(2.2,-3.55) 28(2.6,-3.55) 43(2.6,3.55) 44(2.2,3.55) 45(1.8,3.55) 46(1.4,3.55) 47(1,3.55) 48(0.6,3.55) 49(0.2,3.55) 50(-0.2,3.55) 51(-0.6,3.55) 52(-1,3.55) 53(-1.4,3.55) 54(-1.8,3.55) 55(-2.2,3.55) 56(-2.6,3.55)
  rect 3.1x3.1 smd: 57(0,0)
MSOP-10_L3.0-W3.0-P0.50-LS5.0-BL
  oval 0.28x1.62 smd: 1(-1,-2.11) 2(-0.5,-2.11) 3(0,-2.11) 4(0.5,-2.11) 5(1,-2.11) 6(1,2.11) 7(0.5,2.11) 8(0,2.11) 9(-0.5,2.11) 10(-1,2.11)
OSC-SMD_4P-L2.5-W2.0-BL
  rect 1.2x1.1 smd: 1(-0.95,-0.75) 2(0.95,-0.75) 3(0.95,0.75) 4(-0.95,0.75)
Pad_e2
  round 1.524 hole 0.914: 17(0,0)
Pad_e4
  round 1 hole 0.7: 17(0,0)
Pad_e5
  round 1 hole 0.7: 17(0,0)
Pad_e10
  round 1.524 hole 0.914: 17(0,0)
Pad_e19
  rect 1.6x1.6 hole 1: 7(0,0)
Pad_e37
  rect 1.6x1.6 hole 1: 7(0,0)
Pad_e41
  round 1.6 hole 1.05: 17(0,0)
Pad_e617
  round 1.6 hole 1.05: 17(0,0)
Pad_e620
  round 1.6 hole 1.05: 17(0,0)
Pad_e796
  round 1.6 hole 1.05: 17(0,0)
Pad_e813
  rect 1.6x1.6 hole 1: 7(0,0)
Pad_e833
  rect 1.6x1.6 hole 1: 7(0,0)
Pad_e1305
  round 1.6 hole 1.05: 15(0,0)
Pad_e1583
  round 1.6 hole 1.05: 18(0,0)
Pad_e1763
  round 1.524 hole 0.914: 17(0,0)
Pad_e1784
  round 1.524 hole 0.914: 17(0,0)
Pad_e4139
  round 1.6 hole 1.05: 18(0,0)
R0402
  rect 0.566x0.54 smd: 1(-0.433,0) 2(0.433,0)
SOT-23-3_L2.9-W1.3-P1.90-LS2.4-BR
  rect 1.25x0.7 smd: 1(1,-0.95) 2(1,0.95) 3(-1,0)
SOT-23-3_L2.9-W1.6-P1.90-LS2.8-BR
  rect 1.07x0.6 smd: 1(1.235,-0.95) 2(1.235,0.95) 3(-1.235,0)
SOT-23-6_L2.9-W1.6-P0.95-LS2.8-BR
  rect 1.1x0.6 smd: 1(1.35,-0.95) 2(1.35,0) 3(1.35,0.95) 4(-1.35,0.95) 5(-1.35,0) 6(-1.35,-0.95)
SOT-23_L2.9-W1.3-P1.90-LS2.4-BR
  rect 1x0.8 smd: 1(1.15,-0.95) 2(1.15,0.95) 3(-1.15,0)
USON-8_L3.0-W2.0-P0.50-BL-EP
  rect 0.28x0.6 smd: 1(-0.75,-1.508) 2(-0.25,-1.508) 3(0.25,-1.508) 4(0.75,-1.508) 5(0.75,1.508) 6(0.25,1.508) 7(-0.25,1.508) 8(-0.75,1.508)
  rect 1.7x0.3 smd: 9(0,0)

## Nets
1V1: C8.2 C10.2 C11.2 U1.23 U1.45 U1.50
3V3: C2.2 C4.2 C7.2 C12.2 C13.2 C14.2 C15.2 C16.2 C17.2 C23.2 C26.2 NOREF#3.15 Q1.2 Q2.2 R8.2 R10.2 R13.2 R16.2 R28.2 R29.2 U1.1 U1.10 U1.22 U1.33 U1.36 U1.42 U1.44 U1.48 U1.49 U2.8 U18.5
GND: C2.1 C4.1 C5.1 C7.1 C8.1 C9.1 C10.1 C11.1 C12.1 C13.1 C14.1 C15.1 C16.1 C17.1 C18.1 C19.1 C22.1 C23.1 C26.1 C33.1 C35.1 C38.1 C39.1 NOREF.7 NOREF#6.7 NOREF#8.7 NOREF#9.7 R20.2 R27.1 U1.19 U1.57 U2.4 U3.1 U4.8 U5.1 U5.10 U5.12 U10.1 U11.1 U18.2 X1.1 X1.2 X2.2 X2.4
VBUS: C38.2 L1.2 NOREF#4.18 R21.2 U3.2 U18.3 U18.6
ADC0: U1.38
ADC1: NOREF#13.17 U1.39
ADC2: U1.40
ADC_AVDD: C9.2 R8.1 U1.43
BATT_V: C33.2 R20.1 R21.1 U1.41
BOOTSEL: NOREF#11.18 R17.2
GP12: NOREF#15.17 U1.15
GPS: NOREF#12.17 U5.11
GPS_3V3: C22.2 Q2.3 U5.8
GPS_VCC_ON_N: Q2.1 R28.1 U1.14
I2C0_SCL: U1.3 U4.4
I2C0_SDA: U1.2 U4.5
I2C1_SCL: NOREF#14.17 U1.5
I2C1_SDA: NOREF#2.17 U1.4
LED: R18.2 U1.37
NRESET: U1.26 U10.2
PS: U1.35
QSPI_SCLK: U1.52 U2.6
QSPI_SD0: U1.53 U2.5
QSPI_SD1: U1.55 U2.2
QSPI_SD2: U1.54 U2.3
QSPI_SD3: U1.51 U2.7
QSPI_SS: R16.1 R17.1 U1.56 U2.1
RF_OUT: U1.32
RF_OUT_1: NOREF#16.17 U4.10
RF_OUT_2: NOREF#7.17 U4.9
SWCLK: U1.24
SWD: U1.25
UART1_RX: U1.12 U5.2
UART1_TX: U1.11
USB_DM: NOREF#5.17 R7.2
USB_DP: NOREF#17.17 R6.2
VFO_3V3: C18.2 C19.2 Q1.3 U4.1 U4.7 X1.4
VFO_CLK2: U1.18
VFO_VDD_ON_N: Q1.1 R13.1 U1.29
XIN: C5.2 U1.20 X2.1
XOUT: R22.1 U1.21
$1N22007: R7.1 U1.46
$1N22362: R6.1 U1.47
$1N70752: C39.2 R22.2 X2.3
$1N115739: C35.2 R10.1 U10.3
$1N146095: R18.1 U11.2
$1N152319: L1.1 U18.1
$1N152323: R27.2 R29.1 U18.4
$1N173176: C34.1 U4.2
$1N173179: C34.2 X1.3

Pads without a net: NOREF#10 17; U1 6 7 8 9 13 16 17 27 28 30 31 34; U2 9; U3 3; U4 3 6; U5 3 4 5 6 7 9 13 14 15 16 17 18

## Via types
v1: diameter 0.508, hole 0.3, Top Layer to Bottom Layer, 163 vias

## Routing (per net, layer and track width the routed paths; a pad name or vN(x,y) marks a point on that pad's centre or on a via; arc(x,y) is an arc through that point)
1V1: length 23.9
  Top Layer w0.2: U1.50 11.19,6.25 11.14,6.2 11.14,5.39 v1(11.07,5.33) 11.07,4.69 10.8,4.41 C8.2 10.03,4.36 C11.2 ; v1(10.03,14.35) 10.38,14.01 U1.23 ; v1(10.41,11.76) 10.26,11.92 ; v1(9.91,7.34) 9.66,7.34 9.23,6.91 9.23,6.6
  Top Layer w0.3: v1(10.41,11.76) 12.55,11.76 12.88,11.43 12.88,9.2 12.97,9.11 12.97,8.14 12.46,7.63 10.22,7.63 9.93,7.34 v1(9.91,7.34)
  Bottom Layer w0.2: 10.12,11.76 10.03,11.85 v1(10.03,14.35) ; 10.12,11.76 v1(10.41,11.76) ; 10.12,11.76 9.86,11.76 9.22,12.4 8.91,12.4 v1(7.58,13.72) ; v1(9.91,7.34) 10.05,7.2 10.05,6.96 10.53,6.47 10.75,6.47 11.05,6.18 11.05,5.95 11.07,5.92 v1(11.07,5.33)
3V3: length 89.4
  Top Layer w0.2: R10.2 4.75,11.68 v1(5.21,11.68) ; 10.38,6.26 U1.49 ; 5.33,5.84 4.28,5.84 C15.2 5.18,5.6 C7.2 5.23,5.74 5.33,5.84 ; 5.33,5.84 v1(5.72,5.84) ; 5.33,5.84 5.49,5.99 5.61,5.99 6.63,7.02 ; 13.52,7.21 U1.1 ; 13.33,10.74 13.85,10.74 13.87,10.76 14.48,10.76 U1.10 ; 6.63,7.02 v1(6.63,7.1) ; 6.63,7.02 6.63,5.74 R8.2 ; 8.31,9.61 7.43,9.61 U1.36 ; U1.42 7.51,7.13 8.26,7.13 ; 15.2,6.35 C16.2 15.2,5.21 C4.2 15.97,4.44 15.97,3.53 16.02,3.49 16.02,3.26 v1(15.79,3.03) 15.76,3 15.76,2.84 15.61,2.69 15.53,2.69 15.45,2.61 R16.2 15.11,2.31 U2.8 ; U1.44 8.78,7.27 ; 10.78,12.68 U1.22 ; U1.33 8.24,10.81
  Top Layer w0.3: 5.41,15.47 R13.2 5.41,15.5 5.38,15.5 ; 5.41,15.47 5.46,15.42 ; 5.41,15.47 5.38,15.5 ; 9.07,12.35 10.37,12.35 10.4,12.32 10.76,12.32 ; 10.76,12.32 10.76,12.66 10.78,12.68 ; 10.76,12.32 12.63,12.32 13.33,11.62 13.33,9.39 13.52,9.2 13.52,7.21 ; 15.27,6.41 15.27,6.59 14.75,7.11 14.62,7.11 14.53,7.2 ; 15.27,6.41 15.2,6.35 ; 15.27,6.41 15.98,7.13 17.58,7.13 17.6,7.15 17.68,7.15 17.78,7.25 19.55,7.25 19.69,7.11 20.89,7.11 C2.2 21.62,7.05 C14.2 ; C13.2 25.15,6.77 C23.2 24.21,6.64 23.93,6.92 22.89,6.92 22.57,6.6 ; 8.31,9.61 8.31,10.87 ; 4.62,15.5 4.38,15.74 ; 4.62,15.5 5.38,15.5 ; 4.62,15.5 4.62,14.39 4.6,14.36 4.6,13.58 4.62,13.55 R10.2 ; C14.2 22.31,5.09 22.3,5.08 22.3,4.22 U18.5 ; C14.2 22.57,6.6 ; 10.38,6.26 10.38,6.39 10.61,6.62 10.61,7.05 10.54,7.11 ; 22.57,6.6 C12.2 C17.2 22.57,10.29 C26.2 22.7,10.76 23.31,11.37 Q2.2 25.02,12.01 25.02,12.08 25.56,12.62 25.56,13.67 25.02,14.21 R28.2 ; 8.26,7.13 8.4,7.27 8.4,10.87
  Top Layer w0.4: 8.31,10.87 8.67,11.23 8.67,11.95 9.07,12.35
  Bottom Layer w0.2: NOREF#3.15 4.19,4.32 v1(5.72,5.84) ; 10.57,5.66 10.56,5.66 10.54,5.68 v1(10.54,5.97) 9.91,6.6 9.89,6.6 9.53,6.96 9.32,6.96 9.18,7.1 v1(6.63,7.1) ; v1(15.79,3.03) 15.64,3.18 14.01,3.18 13.72,3.47 13.72,3.73 13.48,3.97 13.48,4.3 13.34,4.44 11.23,4.44 10.57,5.1 10.57,5.66
  Bottom Layer w0.3: v1(5.21,11.68) 8.81,11.68 v1(9.01,11.89)
GND: length 35.5
  Top Layer w0.2: v1(6.86,3.94) 7.78,3.94 C9.1 ; v1(24.13,5.33) 24.13,5.62 C14.1 ; 13.05,3.67 14.21,3.67 v1(14.22,3.68) ; U1.19 12.03,13.4 12.03,14.01 12.17,14.16 12.78,14.16 12.95,14.33 12.95,14.35 13.63,15.03 X2.2 13.33,15.75 13.13,15.75 12.83,16.05 12.83,16.25 12.35,16.72 X2.4 11.78,16.8 C5.1 ; v1(5.97,7.11) 5.5,6.64 C7.1 5.18,6.69 C15.1 ; v1(18.8,10.03) 18.8,10.61 18.77,10.64 18.77,11.84 18.67,11.94 18.67,12.14 18.81,12.28 19.85,12.28 v1(19.88,12.25) ; v1(11.52,2.65) 11.41,2.65 C8.1 10.03,3.27 C11.1 ; v1(20.32,15.62) 20.32,15.36 20.84,14.84 21.56,14.84 U4.8 22.86,14.73 23.35,15.23 23.35,15.32 23.5,15.47 23.6,15.47 23.88,15.75 C19.1 ; U2.4 12.93,4.47 v1(12.93,3.67) ; C4.1 16.8,5.46 C16.1 ; NOREF#9.7 1.65,10 1.23,10.41 ; C33.1 3.38,10.27 v1(3.38,9.72) R20.2 ; v1(9.27,7.75) 9.76,8.23 v1(9.76,8.98)
  Top Layer w0.3: v1(14.22,14.35) 15.75,14.35 v1(15.88,14.48) ; X1.1 X1.2
  Top Layer w0.4: 23.66,9.14 23.79,9.27 C26.1
  vias: v1(0.76,18.61) v1(0.76,15.49) v1(0.76,11.62) v1(0.76,0.64) v1(1.4,1.78) v1(1.5,13.12) v1(2.41,7.49) v1(2.54,18.61) v1(3.23,13.12) v1(3.71,11.01) v1(3.69,7.16) v1(3.94,14.48) v1(5.08,9.14) v1(5.26,16.44) v1(5.46,14.48) v1(5.65,13.3) v1(5.94,4.65) v1(6.03,5.26) v1(5.97,3.05) v1(8.33,15.48) v1(8.33,14.31) v1(9.02,18.8) v1(9.52,3.06) v1(9.53,1.86) v1(9.78,10.8) v1(9.76,9.81) v1(10.55,3.1) v1(10.85,8.98) v1(10.98,10.78) v1(11.05,17.4) v1(11.05,9.81) v1(12.05,9.93) v1(12.06,8.23) v1(12.18,10.78) v1(12.23,9.24) v1(12.95,0.64) v1(14.19,6.59) v1(15.11,1.27) v1(15.49,10.29) v1(15.88,16.38) v1(16.4,5.46) v1(16.51,13.21) v1(17.23,6.47) v1(17.93,6.52) v1(18.13,5.59) v1(18.67,18.8) v1(18.67,16.62) v1(19.27,13.55) v1(19.52,14.73) v1(19.69,0.89) v1(19.81,7.87) v1(21.17,9.24) v1(21.21,5.33) v1(21.84,10.29) v1(22.23,11.81) v1(22.23,2.03) v1(22.35,13.19) v1(23.24,2.92) v1(23.62,17.02) v1(24.26,12.32) v1(24.39,7.55) v1(25.91,8.25) v1(25.91,5.08) v1(26.04,15.37) v1(25.97,9.79) v1(26.08,0.65) v1(26.67,11.25) v1(28.07,12.06) v1(28.46,10.16) v1(28.58,8.27) v1(28.58,6.86) v1(28.58,4.13) v1(28.89,0.59) v1(30.34,10.92) v1(30.34,9.78) v1(30.34,8.64) v1(30.34,7.49) v1(30.34,6.35) v1(30.34,5.21) v1(30.34,4.06) v1(30.34,2.92) v1(30.34,1.78) v1(30.34,0.64) v1(32.24,10.86) v1(32.24,9.72) v1(32.24,8.57) v1(32.24,7.43) v1(32.24,6.29) v1(32.24,5.14) v1(32.24,4) v1(32.24,2.86) v1(32.24,1.71) v1(32.24,0.57) v1(34.32,10.86) v1(34.32,9.72) v1(34.32,8.57) v1(34.32,7.43) v1(34.32,6.29) v1(34.32,5.14) v1(34.32,4) v1(34.32,2.86) v1(34.32,1.71) v1(34.32,0.57) v1(38.74,10.81) v1(38.74,9.53) v1(38.74,8.25) v1(38.74,7.11) v1(38.99,6.35) v1(39.24,0.64)
VBUS: length 34.5
  Top Layer w0.2: U3.2 3.18,4.24 v1(3.18,4.95) 3.18,7.55 R21.2
  Top Layer w0.3: NOREF#4.18 19.56,3.05 L1.2 20.86,3.73 U18.6 21.5,3.67 21.5,3.22 21.67,3.04 22.11,3.04 23.05,2.1 U18.3 23.09,1.27 24.06,1.27
  Bottom Layer w0.2: NOREF#4.18 18.29,4.45 13.9,8.84 12.54,8.84 12.44,8.73 12.02,8.73 11.91,8.84 11.83,8.84 11.63,8.64 11.47,8.64 11.27,8.44 9.46,8.44 9.26,8.64 6.86,8.64 5.84,7.62 5.76,7.62 5.46,7.32 5.46,7.24 v1(3.18,4.95)
(no net): length 1.1
  Top Layer w0.2: NOREF#10.17 3.56,1.65 4.06,2.16 U3.3
ADC1: length 6.6
  Top Layer w0.2: v1(2.67,6.35) NOREF#13.17 ; v1(5.84,8.38) 5.87,8.41 U1.39
  Bottom Layer w0.2: v1(2.67,6.35) 3.81,6.35 v1(5.84,8.38)
ADC_AVDD: length 2.6
  Top Layer w0.2: R8.1 7.53,4.77 C9.2 8,5.88 U1.43
BATT_V: length 5.7
  Top Layer w0.2: U1.41 6.82,7.61 6.73,7.7 4.8,7.7 R21.1 4.5,8.89 4.24,9.14 4.24,10.27 4.47,10.27 C33.2
BOOTSEL: length 2.3
  Top Layer w0.2: NOREF#11.18 17.58,3.1 R17.2
GP12: length 8
  Top Layer w0.2: v1(16.38,18.16) 17.15,18.16 NOREF#15.17 ; U1.15 13.94,13.72 v1(15.24,13.72)
  Bottom Layer w0.2: v1(15.24,13.72) 15.24,17.02 v1(16.38,18.16)
GPS: length 2
  Top Layer w0.4: NOREF#12.17 36.94,2.29 U5.11
GPS_3V3: length 14.4
  Top Layer w0.3: C22.2 25.91,2.63 26.72,2.63 26.94,2.42 U5.8 28.19,2.42 29.14,3.37 29.14,10.51 28.76,10.89 28.23,10.89 26.8,12.32 Q2.3
GPS_VCC_ON_N: length 14.7
  Top Layer w0.2: 24.5,14.16 24.5,14.03 v1(24.43,13.97) ; 24.5,14.16 25.02,13.64 24.75,13.64 Q2.1 ; 24.5,14.16 24.5,15.07 24.64,15.22 ; 24.64,15.22 24.98,15.55 R28.1 24.69,15.22 24.64,15.22 ; U1.14 15.45,12.41 v1(15.49,12.45)
  Bottom Layer w0.2: v1(24.43,13.97) 23.04,12.58 21.13,12.58 21.13,12.57 20.27,12.57 20.02,12.83 19.6,12.83 19.22,12.45 v1(15.49,12.45)
I2C0_SCL: length 8.7
  Top Layer w0.2: U1.3 15.81,8.01 16.16,8.36 16.16,8.78 16,8.93 16,13.51 16.72,14.23 U4.4
I2C0_SDA: length 8.3
  Top Layer w0.2: U4.5 17.45,13.01 16.51,12.07 16.51,8 16.12,7.61 U1.2
I2C1_SCL: length 3.5
  Top Layer w0.2: v1(15.49,9.27) 15.33,9.11 15.33,9 15.13,8.81 U1.5
  Bottom Layer w0.2: NOREF#14.17 16.71,8.38 16.07,9.02 15.75,9.02 v1(15.49,9.27)
I2C1_SDA: length 4.9
  Top Layer w0.2: U1.4 14.58,8.45 15.28,8.45 15.34,8.51 v1(15.6,8.51)
  Bottom Layer w0.2: v1(15.6,8.51) 16.08,8.51 16.96,7.63 18.3,7.63 NOREF#2.17
LED: length 0.8
  Top Layer w0.2: R18.2 6.86,9.22
NRESET: length 9.5
  Top Layer w0.2: 9.13,14.11 9.13,13.98 9.18,13.94 U1.26 ; v1(1.78,14.1) 1.56,14.32 U10.2
  Bottom Layer w0.2: v1(1.78,14.1) 1.84,14.03 3.67,14.03 3.86,13.84 6.99,13.84 7.9,14.75 8.06,14.75 8.12,14.82 8.54,14.82 8.84,14.52 8.84,14.41 9.02,14.22 v1(9.14,14.22)
QSPI_SCLK: length 6.5
  Top Layer w0.2: v1(13.46,2.43) 13.34,2.31 U2.6 ; U1.52 12.03,6.21 12.03,2.76 12.25,2.53 v1(12.25,2.16)
  Bottom Layer w0.2: v1(12.25,2.16) 13.19,2.16 v1(13.46,2.43)
QSPI_SD0: length 5.2
  Top Layer w0.2: U2.5 12.84,1.92 12.76,2 12.76,2.01 12.95,2.2 12.95,2.62 12.93,2.65 12.63,2.65 12.49,2.79 12.49,3.39 12.42,3.46 12.42,6.21 U1.53
QSPI_SD1: length 2
  Top Layer w0.2: U1.55 13.23,6.21 13.23,5.6 13.84,4.99 U2.2
QSPI_SD2: length 1.9
  Top Layer w0.2: U2.3 13.34,4.99 12.83,5.5 12.83,6.21 U1.54
QSPI_SD3: length 7.1
  Top Layer w0.2: U2.7 13.84,1.98 v1(14.22,2.36) ; v1(11.47,3.34) 11.58,3.44 U1.51
  Bottom Layer w0.2: v1(11.47,3.34) 12.54,3.34 12.72,3.16 13.44,3.16 13.96,2.64 13.96,2.62 v1(14.22,2.36)
QSPI_SS: length 5
  Top Layer w0.2: 15.11,3.48 15.13,3.48 v1(15.46,3.81) 14.72,4.56 U2.1 14.34,5.5 U1.56
  Bottom Layer w0.2: v1(15.46,3.81) 15.48,3.82 v1(16.47,3.82)
RF_OUT_1: length 2.7
  Top Layer w0.2: NOREF#16.17 21.67,16.18 U4.10
RF_OUT_2: length 3.5
  Top Layer w0.2: U4.9 21.78,15.34 22.5,15.34 22.73,15.57 22.73,16.29 22.61,16.42 NOREF#7.17
UART1_RX: length 16.3
  Top Layer w0.2: U5.2 28.33,9.02 v1(28.46,9.14) ; v1(15.49,11.23) 15.49,11.25 15.18,11.56 14.58,11.56 U1.12
  Bottom Layer w0.2: v1(15.49,11.23) 20.02,11.23 22.1,9.14 v1(28.46,9.14)
USB_DM: length 3.6
  Top Layer w0.2: R7.2 9.02,2.75 9.4,2.36 10.09,2.36 NOREF#5.17
USB_DP: length 1.5
  Top Layer w0.2: 7.49,1.78 6.93,2.34 R6.2
VFO_3V3: length 29
  Top Layer w0.3: C19.2 23.88,14.13 C18.2 22.51,14.23 U4.7 21.61,14.29 20.81,14.29 19.37,15.73 U4.1 ; 3.43,18.04 15.14,18.04 U4.1 ; U4.1 17.51,15.67 18.3,15.67 18.56,15.42 18.56,13.55 17.72,12.71 X1.4
VFO_VDD_ON_N: length 9.1
  Top Layer w0.2: Q1.1 2.47,15.75 v1(1.78,15.75) ; v1(6.1,14.99) 6.15,15.04 6.28,15.04 ; R13.1 6.28,15.04 ; 6.28,15.04 6.28,13.56 6.57,13.26 6.6,13.26 6.74,13.11 6.74,13.09 U1.29
  Bottom Layer w0.2: v1(1.78,15.75) 2.54,14.99 v1(6.1,14.99)
XIN: length 4.3
  Top Layer w0.2: X2.1 11.26,15.62 10.63,15.62 ; U1.20 11.58,14.67 10.63,15.62 ; 10.63,15.62 C5.2
XOUT: length 4.2
  Top Layer w0.2: 11.18,13.97 U1.21 ; 11.18,13.97 9.2,15.95 R22.1
$1N22007: length 1.5
  Top Layer w0.2: 9.02,5 9.21,5.19 9.26,5.19 9.58,5.51 U1.46
$1N22362: length 4.4
  Top Layer w0.2: R6.1 8.3,3.05 v1(8.41,3.15) ; U1.47 9.93,6.21 9.93,5 v1(9.83,4.9)
  Bottom Layer w0.2: v1(8.41,3.15) 9.35,4.09 9.42,4.09 9.68,4.35 9.68,4.42 9.83,4.58 v1(9.83,4.9)
$1N70752: length 7.5
  Top Layer w0.2: v1(13.34,16.26) 13.59,16.26 X2.3
  Top Layer w0.3: v1(7.62,16.76) R22.2
  Bottom Layer w0.2: v1(7.62,16.76) 8.13,16.26 v1(13.34,16.26)
$1N115739: length 2.9
  Top Layer w0.2: R10.1 3.72,11.85 U10.3 2.29,10.45 C35.2
$1N146095: length 0.9
  Top Layer w0.2: U11.2 6.1,10.09 R18.1
$1N152319: length 5.3
  Top Layer w0.3: U18.1 21.15,1.97 v1(21.21,2.03) ; L1.1 19.69,5.8 v1(19.69,5.21)
  Bottom Layer w0.3: v1(19.69,5.21) 19.69,3.56 v1(21.21,2.03)
$1N152323: length 2.5
  Top Layer w0.2: 23.17,5.08 23.05,4.96 U18.4
  Top Layer w0.3: U18.4 24.23,4.02 R27.2
$1N173176: length 8.1
  Top Layer w0.2: C34.1 v1(21.08,13.08) ; U4.2 17.44,15.24 v1(16.13,15.24)
  Bottom Layer w0.2: v1(16.13,15.24) 16.76,14.61 18.93,14.61 20.45,13.08 v1(21.08,13.08)
$1N173179: length 1.6
  Top Layer w0.2: C34.2 20.8,11.29 X1.3

## Copper pours and planes (outline as drawn; the poured copper is in the pictures)
3V3 on Top Layer: 10.34,7.33 17.4,7.33 17.4,7.11 10.34,7.11
3V3 on Top Layer: 13.27,12.6 13.64,12.6 13.64,7.04 13.27,7.04
3V3 on Top Layer: 8.82,12.6 13.64,12.6 13.64,12.22 8.82,12.22
3V3 on Top Layer: 8.25,12.6 8.82,12.6 8.82,7.08 8.25,7.08
GND on Top Layer: -15.62,21.84 45.97,21.84 45.97,-2.41 -15.62,-2.41
GND on Bottom Layer: -20.83,28.07 43.05,28.07 43.05,-18.92 -20.83,-18.92

Small or netless copper shapes (teardrops, artwork), in the pictures only: 2 on Top Layer

## Text on the board
Bottom Silkscreen Layer: I2C1 SCL | I2C1 SDA | USB | D- D+ | BOOT | VBUS must be less than 3.3V | GND | VBUS | 5V | 3.3v out | ADC1 DS18 | GPIO 12 | RF RF | KC3LBR JAWBONE v8 | GPS
Top Silkscreen Layer: please email: | GND | +USB- | if found | JAWBONE | GP12 | ADC1 | BOOT | VBUS | KC3LBR | RVOTIN@yahoo.com | -RF- | GPS | 3V3 | 5V | v8
